# Altium schematic sheet 0402B471K500NT1_0402B471K500NT.schdoc
size 124 x 101 mm
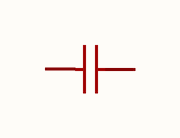
[diagram p0: 0402B471K500NT1_0402B471K500NT.schdoc]

## Parts
C?  470pF  [C0402]  (value not drawn)

## Nets

Not connected (* = marked no-connect by the designer): C? 1 2

## Library data of the parts
C? = 0402B471K500NT: Manufacturer: FH(风华); Add into BOM: yes; Tolerance: ±10%; Voltage Rating: 50V; Temperature Coefficient: X7R; Symbol: 0402B471K500NT; Device: 0402B471K500NT; LCSC Part Name: 470pF ±10% 50V; Supplier Part: C1537; Manufacturer Part: 0402B471K500NT; Supplier Footprint: 0402; JLCPCB Part Class: Extended Part; Datasheet: https://item.szlcsc.com/datasheet/0402B471K500NT/1889.html; Supplier: LCSC; Convert to PCB: yes; Value: 470pF